# Altium schematic sheet power-v3.SchDoc
size Letter; CompanyName: Signal Laboratories, Inc.; Address1: 3479 Edison Way; Address2: Menlo Park CA 94025; Address3: +1 (877) 778-8435; Address4: siglabs.com; Revision: 1; SheetNumber: 40; SheetTotal: 45
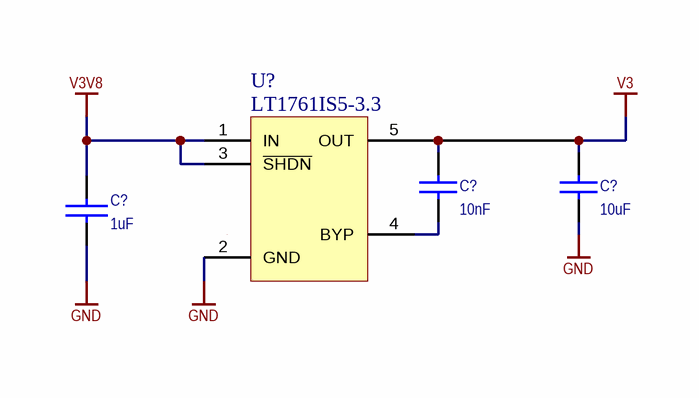
[diagram p0: power-v3.SchDoc]

## Parts
(Parts that share a designator on the sheet are numbered #1, #2 ... from top to bottom, then left to right.)
C?#1  value 10nF  [CAPC100X50X55L25N]  (hidden comment: GRM155R71H103KA88)
C?#2  value 10uF  [0603]  (hidden comment: CL10A106MA8NRNC)
C?#3  value 1uF  [CAPC100X50X55L25N]  (hidden comment: GRM155R61A105KE15D)
U?  LT1761IS5-3.3  [TSOT-5]

## Nets
GND: C?#2.1 C?#3.1 U?.2(GND)
V3: C?#1.2 C?#2.2 U?.5(OUT)
V3V8: C?#3.2 U?.1(IN) U?.3(~{SHDN})
NetC?#1_1: C?#1.1 U?.4(BYP)

## Notes on the sheet
- Title
- Engineer
- Revision
- Drawn By
- Checked By
- Date
- Sheet
- of

## Library data of the parts
C?#1 = CAP 0402: Ceramic Capacitor 10nF ±10% 50V X7R 0402; Manufacturer: Murata; Tr: -55:125; Voltage: 50V; Manufacturer P/N: GRM155R71H103KA88; Package: 0402; Tolerance: ±10%
C?#2 = CAP 0603: Ceramic Capacitor 10uF ±20% 25V X5R 0603; Manufacturer: Samsung; Tr: -55:85; Manufacturer P/N: CL10A106MA8NRNC; Voltage: 25V; Package: 0603; Tolerance: ±20%
C?#3 = CAP: Ceramic Capacitor 1uF ±10% 10V X5R 0402; Manufacturer: Murata; Tr: -55:125; Manufacturer P/N: GRM155R61A105KE15D; Package: 0402; Tolerance: ±10%; Voltage: 10V
U? = LT1761IS5-5: 100mA Low Noise LDO 5V; Manufacturer: Linear Technologies; Manufacturer P/N: LT1761IS5-5